# EAGLE design HECU_2.0 (EAGLE 9.6.2)
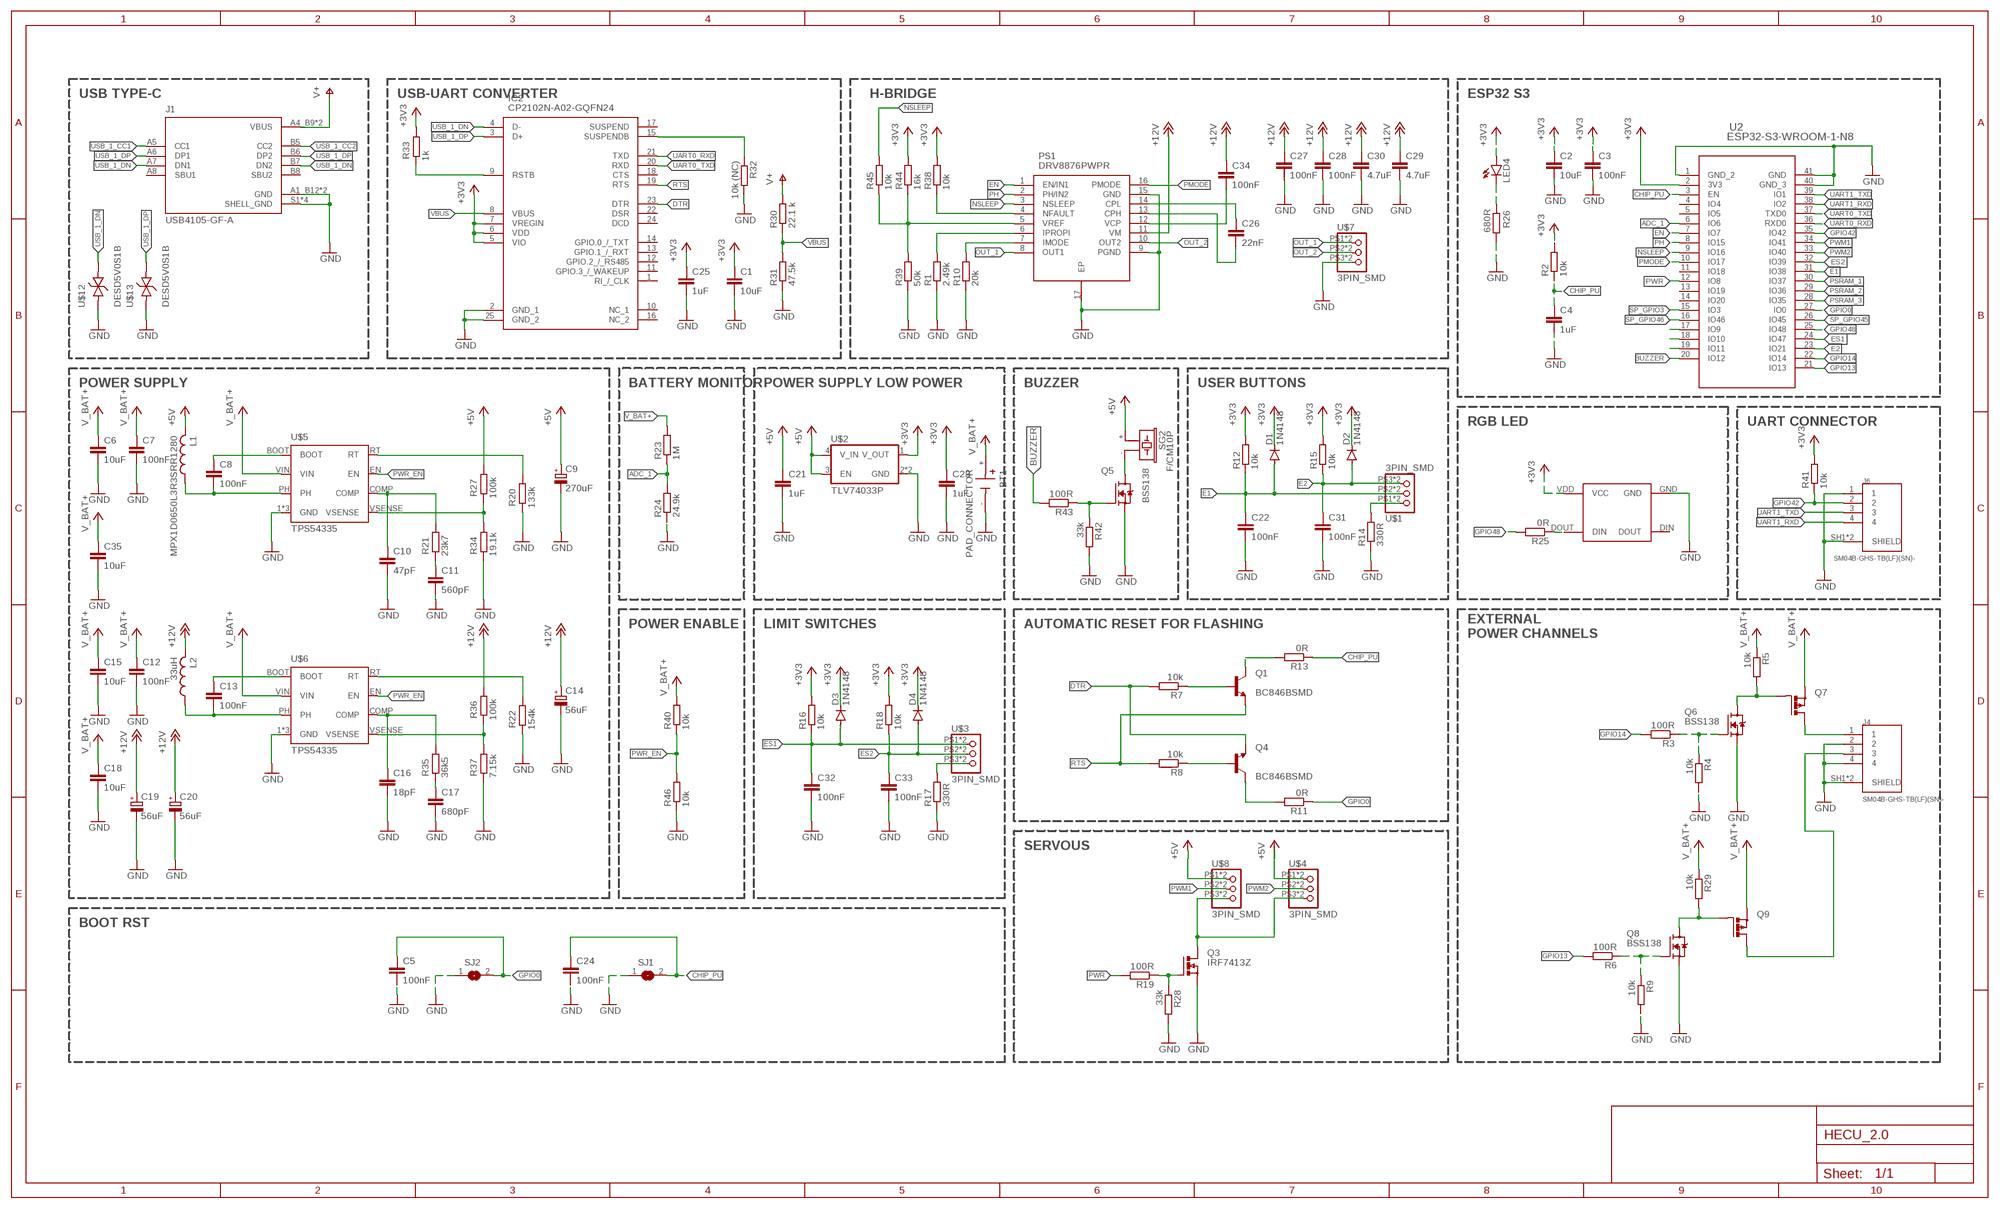
[diagram p0: schematic, sheet 1]

## Parts
BT1  PAD_CONNECTOR  [BAT_PADS]
C1  10uF  C-EUC0805  [C0805]
C2  10uF  C-EUC0805  [C0805]
C3  100nF  C-EUC0603  [C0603]
C4  1uF  C-EUC0603  [C0603]
C5  100nF  C-EUC0603  [C0603]
C6  10uF  C-EUC0805  [C0805]
C7  100nF  C-EUC0603  [C0603]
C8  100nF  C-EUC0603  [C0603]
C9  270uF  CPOL-EUE  [PANASONIC_E]
C10  47pF  C-EUC0603  [C0603]
C11  560pF  C-EUC0603  [C0603]
C12  100nF  C-EUC0603  [C0603]
C13  100nF  C-EUC0603  [C0603]
C14  56uF  CPOL-EUC  [PANASONIC_C]
C15  10uF  C-EUC0805  [C0805]
C16  18pF  C-EUC0603  [C0603]
C17  680pF  C-EUC0603  [C0603]
C18  10uF  C-EUC0805  [C0805]
C19  56uF  CPOL-EUC  [PANASONIC_C]
C20  56uF  CPOL-EUC  [PANASONIC_C]
C21  1uF  C-EUC0603  [C0603]
C22  100nF  C-EUC0603  [C0603]
C23  1uF  C-EUC0603  [C0603]
C24  100nF  C-EUC0603  [C0603]
C25  1uF  C-EUC0603  [C0603]
C26  22nF  C-EUC0603  [C0603]
C27  100nF  C-EUC0603  [C0603]
C28  100nF  C-EUC0603  [C0603]
C29  4.7uF  C-EUC0603  [C0603]
C30  4.7uF  C-EUC0603  [C0603]
C31  100nF  C-EUC0603  [C0603]
C32  100nF  C-EUC0603  [C0603]
C33  100nF  C-EUC0603  [C0603]
C34  100nF  C-EUC0603  [C0603]
C35  10uF  C-EUC0805  [C0805]
D1  1N4148  1N4148SOD80C  [SOD80C]
D2  1N4148  1N4148SOD80C  [SOD80C]
D3  1N4148  1N4148SOD80C  [SOD80C]
D4  1N4148  1N4148SOD80C  [SOD80C]
IC2  CP2102N-A02-GQFN24  [QFN50P400X400X80-25N]
J1  USB4105-GF-A  [GCT_USB4105-GF-A]
J4  SM04B-GHS-TB(LF)(SN)-  [JST_SM04B-GHS-TB(LF)(SN)-]
J6  SM04B-GHS-TB(LF)(SN)-  [JST_SM04B-GHS-TB(LF)(SN)-]
L1  MPX1D0650L3R3SRR1280  [COIL_SRR1280]
L2  33uH  MPX1D0650L3R3COIL_MSS1210  [COIL_MSS1210]
LED4  LEDCHIPLED_0805  [CHIPLED_0805]
PS1  DRV8876PWPR  [SOP65P640X120-17N]
Q1  BC846BSMD  [SOT23]
Q3  IRF7413Z  N-MOSFET-SO8S  [SO-08]
Q4  BC846BSMD  [SOT23]
Q5  BSS138  [SOT23]
Q6  BSS138  [SOT23]
Q7  P-MOSFET-SO8  [SO-08]
Q8  BSS138  [SOT23]
Q9  P-MOSFET-SO8  [SO-08]
R1  2.49k  R-EU_R0603  [R0603]
R2  10k  R-EU_R0603  [R0603]
R3  100R  R-EU_R0603  [R0603]
R4  10k  R-EU_R0603  [R0603]
R5  10k  R-EU_R0603  [R0603]
R6  100R  R-EU_R0603  [R0603]
R7  10k  R-EU_R0603  [R0603]
R8  10k  R-EU_R0603  [R0603]
R9  10k  R-EU_R0603  [R0603]
R10  20k  R-EU_R0603  [R0603]
R11  0R  R-EU_R0603  [R0603]
R12  10k  R-EU_R0603  [R0603]
R13  0R  R-EU_R0603  [R0603]
R14  330R  R-EU_R0603  [R0603]
R15  10k  R-EU_R0603  [R0603]
R16  10k  R-EU_R0603  [R0603]
R17  330R  R-EU_R0603  [R0603]
R18  10k  R-EU_R0603  [R0603]
R19  100R  R-EU_R0603  [R0603]
R20  133k  R-EU_R0603  [R0603]
R21  23k7  R-EU_R0603  [R0603]
R22  154k  R-EU_R0603  [R0603]
R23  1M  R-EU_R0603  [R0603]
R24  24.9k  R-EU_R0603  [R0603]
R25  0R  R-EU_R0603  [R0603]
R26  680R  R-EU_R0603  [R0603]
R27  100k  R-EU_R0603  [R0603]
R28  33k  R-EU_R0603  [R0603]
R29  10k  R-EU_R0603  [R0603]
R30  22.1 k  R-EU_R0603  [R0603]
R31  47.5k  R-EU_R0603  [R0603]
R32  10k (NC)  R-EU_R0603  [R0603]
R33  1k  R-EU_R0603  [R0603]
R34  19.1k  R-EU_R0603  [R0603]
R35  36k5  R-EU_R0603  [R0603]
R36  100k  R-EU_R0603  [R0603]
R37  7.15k  R-EU_R0603  [R0603]
R38  10k  R-EU_R0603  [R0603]
R39  50k  R-EU_R0603  [R0603]
R40  10k  R-EU_R0603  [R0603]
R41  10k  R-EU_R0603  [R0603]
R42  33k  R-EU_R0603  [R0603]
R43  100R  R-EU_R0603  [R0603]
R44  16k  R-EU_R0603  [R0603]
R45  10k  R-EU_R0603  [R0603]
R46  10k  R-EU_R0603  [R0603]
RGB1  SK6812MINI  [2020REVMNT]
SG2  F/CM10P  [F/CM10P]
SJ1  SJ  [SJ]
SJ2  SJ  [SJ]
U2  ESP32-S3-WROOM-1-N8  [ESP32-S3-WROOM-1-N8_EXP]
U$1  3PIN_SMD  [3PIN_PAD]
U$2  TLV74033P  [SUP_TPS3831L30DQNR]
U$3  3PIN_SMD  [3PIN_PAD]
U$4  3PIN_SMD  [3PIN_PAD]
U$5  TPS54335  TPS54325  [DDA0008E_L]
U$6  TPS54335  TPS54325  [DDA0008E_L]
U$7  3PIN_SMD  [3PIN_PAD]
U$8  3PIN_SMD  [3PIN_PAD]
U$12  DESD5V0S1B  [DIO_BAS316_RRG]
U$13  DESD5V0S1B  [DIO_BAS316_RRG]

## Nets
+3V3: C1.1 C2.1 C3.1 C23.1 C25.1 D1.C D2.C D3.C D4.C IC2.5(VIO) IC2.6(VDD) IC2.7(VREGIN) LED4.A R2.2 R12.2 R15.2 R16.2 R18.2 R33.1 R38.2 R41.2 R44.2 RGB1.VDD(VCC) U2.2(3V3) U$2.1(V_OUT)
+5V: C9.+ C21.1 L1.2 R27.1 SG2.+ U$2.3(EN) U$2.4(V_IN) U$4.P$1 U$4.P$4 U$8.P$1 U$8.P$4
+12V: C14.+ C19.+ C20.+ C27.1 C28.1 C29.1 C30.1 C34.1 L2.2 PS1.11(VM) R36.1
ADC_1: R23.1 R24.2 U2.6(IO6)
BUZZER: R43.2 U2.20(IO12)
CHIP_PU: C4.1 C24.1 R2.1 R13.1 SJ1.2 U2.3(EN)
DTR: IC2.23(DTR) Q4.2(E) R7.2
E1: C22.1 D1.A R12.1 U2.31(IO38) U$1.P$2 U$1.P$5
E2: C31.1 D2.A R15.1 U2.23(IO21) U$1.P$3 U$1.P$6
EN: PS1.1(EN/IN1) U2.7(IO7)
ES1: C32.1 D3.A R16.1 U2.24(IO47) U$3.P$1 U$3.P$4
ES2: C33.1 D4.A R18.1 U2.32(IO39) U$3.P$2 U$3.P$5
GND: BT1.- C1.2 C2.2 C3.2 C4.2 C5.2 C6.2 C7.2 C9.- C10.2 C11.2 C12.2 C14.- C15.2 C16.2 C17.2 C18.2 C19.- C20.- C21.2 C22.2 C23.2 C24.2 C25.2 C27.2 C28.2 C29.2 C30.2 C31.2 C32.2 C33.2 C35.2 IC2.2(GND_1) IC2.25(GND_2) J1.A1_B12(GND) J1.B1_A12(GND) J1.S1(SHELL_GND) J1.S2(SHELL_GND) J1.S3(SHELL_GND) J1.S4(SHELL_GND) J4.2 J4.4 J4.SH1(SHIELD) J4.SH2(SHIELD) J6.1 J6.SH1(SHIELD) J6.SH2(SHIELD) PS1.9(PGND) PS1.15(GND) PS1.17(EP) Q3.1(S) Q3.2(S) Q3.3(S) Q5.2(S) Q6.2(S) Q8.2(S) R1.1 R4.2 R9.2 R10.1 R14.1 R17.1 R20.2 R22.2 R24.1 R26.1 R28.2 R31.1 R32.2 R34.2 R37.2 R39.1 R42.2 R46.1 RGB1.GND SJ1.1 SJ2.1 U2.1(GND_2) U2.40(GND_3) U2.41(GND) U$2.2(GND) U$2.5(GND) U$5.1(GND) U$5.9(GND) U$5.GND U$6.1(GND) U$6.9(GND) U$6.GND U$7.P$3 U$7.P$6 U$12.A U$13.A
GPIO0: C5.1 R11.1 SJ2.2 U2.27(IO0)
GPIO13: R6.2 U2.21(IO13)
GPIO14: R3.2 U2.22(IO14)
GPIO42: J6.2 R41.1 U2.35(IO42)
GPIO48: R25.2 U2.25(IO48)
N$1: R17.2 U$3.P$3 U$3.P$6
N$2: R14.2 U$1.P$1 U$1.P$4
N$3: J4.1 Q7.5(D) Q7.6(D) Q7.7(D) Q7.8(D)
N$4: Q1.3(C) R13.2
N$5: Q6.1(G) R3.1 R4.1
N$6: Q4.3(C) R11.2
N$7: R20.1 U$5.RT
N$8: C10.1 R21.1 U$5.COMP
N$9: C8.1 U$5.BOOT
N$10: Q4.1(B) R8.1
N$11: Q5.3(D) SG2.-
N$12: Q1.1(B) R7.1
N$13: IC2.15(SUSPENDB) R32.1
N$14: Q6.3(D) Q7.4(G) R5.2
N$15: Q3.5(D) Q3.6(D) Q3.7(D) Q3.8(D) U$4.P$3 U$4.P$6 U$8.P$3 U$8.P$6
N$16: R25.1 RGB1.DOUT(DIN)
N$17: LED4.C R26.2
N$18: Q8.1(G) R6.1 R9.1
N$19: Q8.3(D) Q9.4(G) R29.2
N$20: Q5.1(G) R42.1 R43.1
N$21: C8.2 L1.1 U$5.PH
N$22: IC2.9(RSTB) R33.2
N$23: R27.2 R34.1 U$5.VSENSE
N$24: C11.1 R21.2
N$25: R22.1 U$6.RT
N$26: C16.1 R35.1 U$6.COMP
N$27: C13.1 U$6.BOOT
N$28: C13.2 L2.1 U$6.PH
N$29: J4.3 Q9.5(D) Q9.6(D) Q9.7(D) Q9.8(D)
N$30: R36.2 R37.1 U$6.VSENSE
N$31: Q3.4(G) R19.1 R28.1
N$32: C17.1 R35.2
N$34: C34.2 PS1.12(VCP)
N$35: C26.1 PS1.14(CPL)
N$36: C26.2 PS1.13(CPH)
N$38: PS1.6(IPROPI) R1.2
N$39: PS1.7(IMODE) R10.2
N$40: PS1.4(NFAULT) R38.1
N$41: PS1.5(VREF) R39.2 R44.1 R45.1
NSLEEP: PS1.3(NSLEEP) R45.2 U2.9(IO16)
OUT_1: PS1.8(OUT1) U$7.P$1 U$7.P$4
OUT_2: PS1.10(OUT2) U$7.P$2 U$7.P$5
PD_INT: U2.17(IO9)
PD_SCL: U2.19(IO11)
PD_SDA: U2.18(IO10)
PH: PS1.2(PH/IN2) U2.8(IO15)
PMODE: PS1.16(PMODE) U2.10(IO17)
PSRAM_1: U2.30(IO37)
PSRAM_2: U2.29(IO36)
PSRAM_3: U2.28(IO35)
PWM1: U2.34(IO41) U$8.P$2 U$8.P$5
PWM2: U2.33(IO40) U$4.P$2 U$4.P$5
PWR: R19.2 U2.12(IO8)
PWR_EN: R40.1 R46.2 U$5.EN U$6.EN
RTS: IC2.19(RTS) Q1.2(E) R8.2
SP_GPIO3: U2.15(IO3)
SP_GPIO45: U2.26(IO45)
SP_GPIO46: U2.16(IO46)
UART0_RXD: IC2.21(TXD) U2.36(RXD0)
UART0_TXD: IC2.20(RXD) U2.37(TXD0)
UART1_RXD: J6.4 U2.38(IO2)
UART1_TXD: J6.3 U2.39(IO1)
USB_1_CC1: J1.A5(CC1)
USB_1_CC2: J1.B5(CC2)
USB_1_DN: IC2.4(D-) J1.A7(DN1) J1.B7(DN2) U$12.C
USB_1_DP: IC2.3(D+) J1.A6(DP1) J1.B6(DP2) U$13.C
V+: J1.A4_B9(VBUS) J1.B4_A9(VBUS) R30.2
V_BAT+: BT1.+ C6.1 C7.1 C12.1 C15.1 C18.1 C35.1 Q7.1(S) Q7.2(S) Q7.3(S) Q9.1(S) Q9.2(S) Q9.3(S) R5.1 R23.2 R29.1 R40.2 U$5.VIN U$6.VIN
VBUS: IC2.8(VBUS) R30.1 R31.2
Unconnected: IC2.1(RI_/_CLK) IC2.10(NC_1) IC2.11(GPIO.3_/_WAKEUP) IC2.12(GPIO.2_/_RS485) IC2.13(GPIO.1_/_RXT) IC2.14(GPIO.0_/_TXT) IC2.16(NC_2) IC2.17(SUSPEND) IC2.18(CTS) IC2.22(DSR) IC2.24(DCD) J1.A8(SBU1) J1.B8(SBU2) RGB1.DIN(DOUT) U2.4(IO4) U2.5(IO5) U2.11(IO18) U2.13(IO19) U2.14(IO20)

## Notes on the sheet
- USB TYPE-C | USB-UART CONVERTER | H-BRIDGE | ESP32 S3
- POWER SUPPLY | BATTERY MONITOR | POWER SUPPLY LOW POWER | BUZZER | USER BUTTONS
- RGB LED | UART CONNECTOR
- POWER ENABLE | LIMIT SWITCHES | AUTOMATIC RESET FOR FLASHING
- EXTERNAL
  POWER CHANNELS
- SERVOUS
- BOOT RST

## Library data of the parts
BT1 = PUTRocketLab_connectors:PAD_CONNECTOR: Battery Holder (Open) 18650 1 Cell PC Pin Check availability <https://pricing.snapeda.com/parts/BK-18650-PC2/MPD%20%28Memory%20Protection%20Devices%29/view-part?ref=eda>
C1-C8 C10-C13 C15-C18 C21-C35 = PUTRocketLab_RCL:C-EU: CAPACITOR, European symbol; SPICEPREFIX: C
C9 C14 C19 C20 = PUTRocketLab_RCL:CPOL-EU: POLARIZED CAPACITOR, European symbol; SPICEPREFIX: C
D1-D4 = PUTRocketLab_semiconductors:1N4148: DIODE
IC2 = PUTRocketLab_IC:CP2102N-A02-GQFN24: USB Interface IC USB to UART bridge - QFN24 Source: Datasheet <https://componentsearchengine.com/Datasheets/1/CP2102N-A02-GQFN24.pdf> Check availability <https://pricing.snapeda.com/parts/CP2102N-A02-GQFN24/Silicon%20Labs/view-part?ref=eda>; AVAILABILITY: In Stock; DESCRIPTION: USB Bridge, USB to UART USB 2.0 UART Interface 24-QFN (4x4); MF: Silicon Labs; MP: CP2102N-A02-GQFN24; PACKAGE: WFQFN-24 Silicon Labs; PRICE: None; PURCHASE-URL: https://pricing.snapeda.com/search/part/CP2102N-A02-GQFN24/?ref=eda
J1 = PUTRocketLab_connectors:USB4105-GF-A: USB-C (USB TYPE-C) USB 2.0 Receptacle Connector 24 (16+8 Dummy) Position Surface Mount, Right Angle; Through Hole Check availability <https://pricing.snapeda.com/parts/USB4105-GF-A/GCT/view-part?ref=eda>; AVAILABILITY: In Stock; DESCRIPTION: USB-C (USB TYPE-C) USB 2.0 Receptacle Connector 24 (16+8 Dummy) Position Surface Mount, Right Angle; Through Hole; MF: GCT; MP: USB4105-GF-A; PACKAGE: None; PRICE: None; PURCHASE-URL: https://pricing.snapeda.com/search/part/USB4105-GF-A/?ref=eda
J4 J6 = PUTRocketLab_connectors:SM04B-GHS-TB(LF)(SN)-: Conn Header Gh Side 4pos 1.25mm; DESCRIPTION: Connector Header Surface Mount, Right Angle 4 position 0.049 (1.25mm); DIGI-KEY_PART_NUMBER: 455-1566-6-ND; MF: JST Sales; MP: SM04B-GHS-TB(LF)(SN)-; PACKAGE: None; PURCHASE-URL: https://pricing.snapeda.com/search/part/SM04B-GHS-TB(LF)(SN)-/?ref=eda
L1 L2 = PUTRocketLab_RCL:MPX1D0650L3R3
LED4 = PUTRocketLab_semiconductors:LED: LED OSRAM: - CHIPLED LG R971, LG N971, LY N971, LG Q971, LY Q971, LO R971, LY R971 LH N974, LH R974 LS Q976, LO Q976, LY Q976 LO Q996 - Hyper CHIPLED LW Q18S LB Q993, LB Q99A, LB R99A - SideLED LS A670, LO A670, LY A670, LG A670, LP A670 LB A673, LV A673, LT A673, LW A673 LH A674 LY A675 LS A676, LA A676, LO A676, LY A676, LW A676 LS A679, LY A679, LG A679 - Hyper Micro SIDELED® LS Y876, LA Y876, LO Y876, LY Y876 LT Y87S - SmartLED LW L88C, LW L88S LB L89C, LB L89S, LG L890 LS L89K, LO L89K, LY L89K LS L896, LA L896, LO L896, LY L896 - TOPLED LS T670, LO T670, LY T670, LG T670, LP T670 LSG T670, LSP T670, LSY T670, LOP T670, LYG T670 LG T671, LOG T671, LSG T671 LB T673, LV T673, LT T673, LW T673 LH T674 LS T676, LA T676, LO T676, LY T676, LB T676, LH T676, LSB T676, LW T676 LB T67C, LV T67C, LT T67C, LS T67K, LO T67K, LY T67K, LW E67C LS E67B, LA E67B, LO E67B, LY E67B, LB E67C, LV E67C, LT E67C LW T67C LS T679, LY T679, LG T679 LS T770, LO T770, LY T770, LG T770, LP T770 LB T773, LV T773, LT T773, LW T773 LH T774 LS E675, LA E675, LY E675, LS T675 LS T776, LA T776, LO T776, LY T776, LB T776 LHGB T686 LT T68C, LB T68C - Hyper Mini TOPLED® LB M676 - Mini TOPLED Santana® LG M470 LS M47K, LO M47K, LY M47K Source: http://www.osram.convergy.de LUXEON: - LUMILED® LXK2-PW12-R00, LXK2-PW12-S00, LXK2-PW14-U00, LXK2-PW14-V00 LXK2-PM12-R00, LXK2-PM12-S00, LXK2-PM14-U00 LXK2-PE12-Q00, LXK2-PE12-R00, LXK2-PE12-S00, LXK2-PE14-T00, LXK2-PE14-U00 LXK2-PB12-K00, LXK2-PB12-L00, LXK2-PB12-M00, LXK2-PB14-N00, LXK2-PB14-P00, LXK2-PB14-Q00 LXK2-PR12-L00, LXK2-PR12-M00, LXK2-PR14-Q00, LXK2-PR14-R00 LXK2-PD12-Q00, LXK2-PD12-R00, LXK2-PD12-S00 LXK2-PH12-R00, LXK2-PH12-S00 LXK2-PL12-P00, LXK2-PL12-Q00, LXK2-PL12-R00 Source: www.luxeon.com KINGBRIGHT: KA-3528ASYC Source: www.kingbright.com
PS1 = PUTRocketLab_IC:DRV8876PWPR: 37-V, 3.5-A brushed DC motor driver with integrated current sensing and current sense output Source: Datasheet <http://www.ti.com/lit/ds/symlink/drv8876.pdf>; DESCRIPTION: 37-V, 3.5-A brushed DC motor driver with integrated current sensing and current sense output; HEIGHT: 1.2mm; MANUFACTURER_NAME: Texas Instruments; MANUFACTURER_PART_NUMBER: DRV8876PWPR; MOUSER_PART_NUMBER: 595-DRV8876PWPR; MOUSER_PRICE-STOCK: https://www.mouser.co.uk/ProductDetail/Texas-Instruments/DRV8876PWPR?qs=PqoDHHvF64%252BBALOlUWTZeA%3D%3D
Q1 Q4 = PUTRocketLab_semiconductors:BC846*: NPN Transistor
Q3 = PUTRocketLab_semiconductors:N-MOSFET-SO8: N-Channel MOSFET Example: FDS7760A; N-Channel Logic Level PowerTrench® MOSFET FDS2572; N-Channel UltraFET® Trench MOSFET Source: www.fairchildsemi.com
Q5 Q6 Q8 = PUTRocketLab_semiconductors:BSS138: BSS138 N-Channel Logic Level Enhancement Mode Field Effect Transistor Source: http://www.fairchildsemi.com/datasheets/BS/BSS138.pdf; MF: Fairchild; MPN: BSS138; OC_FARNELL: 9845330; OC_NEWARK: 67R2009
Q7 Q9 = PUTRocketLab_semiconductors:P-MOSFET-SO8: P-Channel MOSFET Example: FDS4435A; P-Channel Logic Level PowerTrench® MOSFET FDS4465; P-Channel 1.8V Specified PowerTrench® MOSFET Source: www.fairchildsemi.com
R1-R46 = PUTRocketLab_RCL:R-EU_: RESISTOR, European symbol; SPICEPREFIX: R
RGB1 = PUTRocketLab_IC:SK6812MINI: Check availability <https://pricing.snapeda.com/parts/SK6812MINI/DONGGUANG%20OPSCO%20OPTOELECTRONICS%20CO.%2C%20LTD/view-part?ref=eda>; AVAILABILITY: Not in stock; DESCRIPTION: INTEGRATED LIGHT SOURCE INTELLIGENT CONTROL OF CHIP-ON-TOP SMD TYPE LED; MF: DONGGUANG OPSCO OPTOELECTRONICS CO., LTD; MP: SK6812MINI; PACKAGE: Package; PRICE: None
SG2 = PUTRocketLab_misc:F/CM10P: BUZZER Source: Buerklin
SJ1 SJ2 = PUTRocketLab_misc:SJ: SMD solder JUMPER
U2 = esp32-s3:ESP32-S3-WROOM-1-N8; COPYRIGHT: Copyright (C) 2022 Ultra Librarian. All rights reserved.; DIGI-KEY_PART_NUMBER_1: 1965-ESP32-S3-WROOM-1-N8TR-ND; DIGI-KEY_PART_NUMBER_2: 1965-ESP32-S3-WROOM-1-N8CT-ND; DIGI-KEY_PART_NUMBER_3: 1965-ESP32-S3-WROOM-1-N8DKR-ND; MANUFACTURER_PART_NUMBER: ESP32-S3-WROOM-1-N8; MFR_NAME: Espressif Systems
U$1 U$3 U$4 U$7 U$8 = PUTRocketLab_connectors:3PIN_SMD
U$2 = PUTRocketLab_IC:TLV74033P
U$5 U$6 = PUTRocketLab_IC:TPS54325
U$12 U$13 = PUTRocketLab_semiconductors:DESD5V0S1B

## Net classes
1 U1: width 0.203 mm

## Board
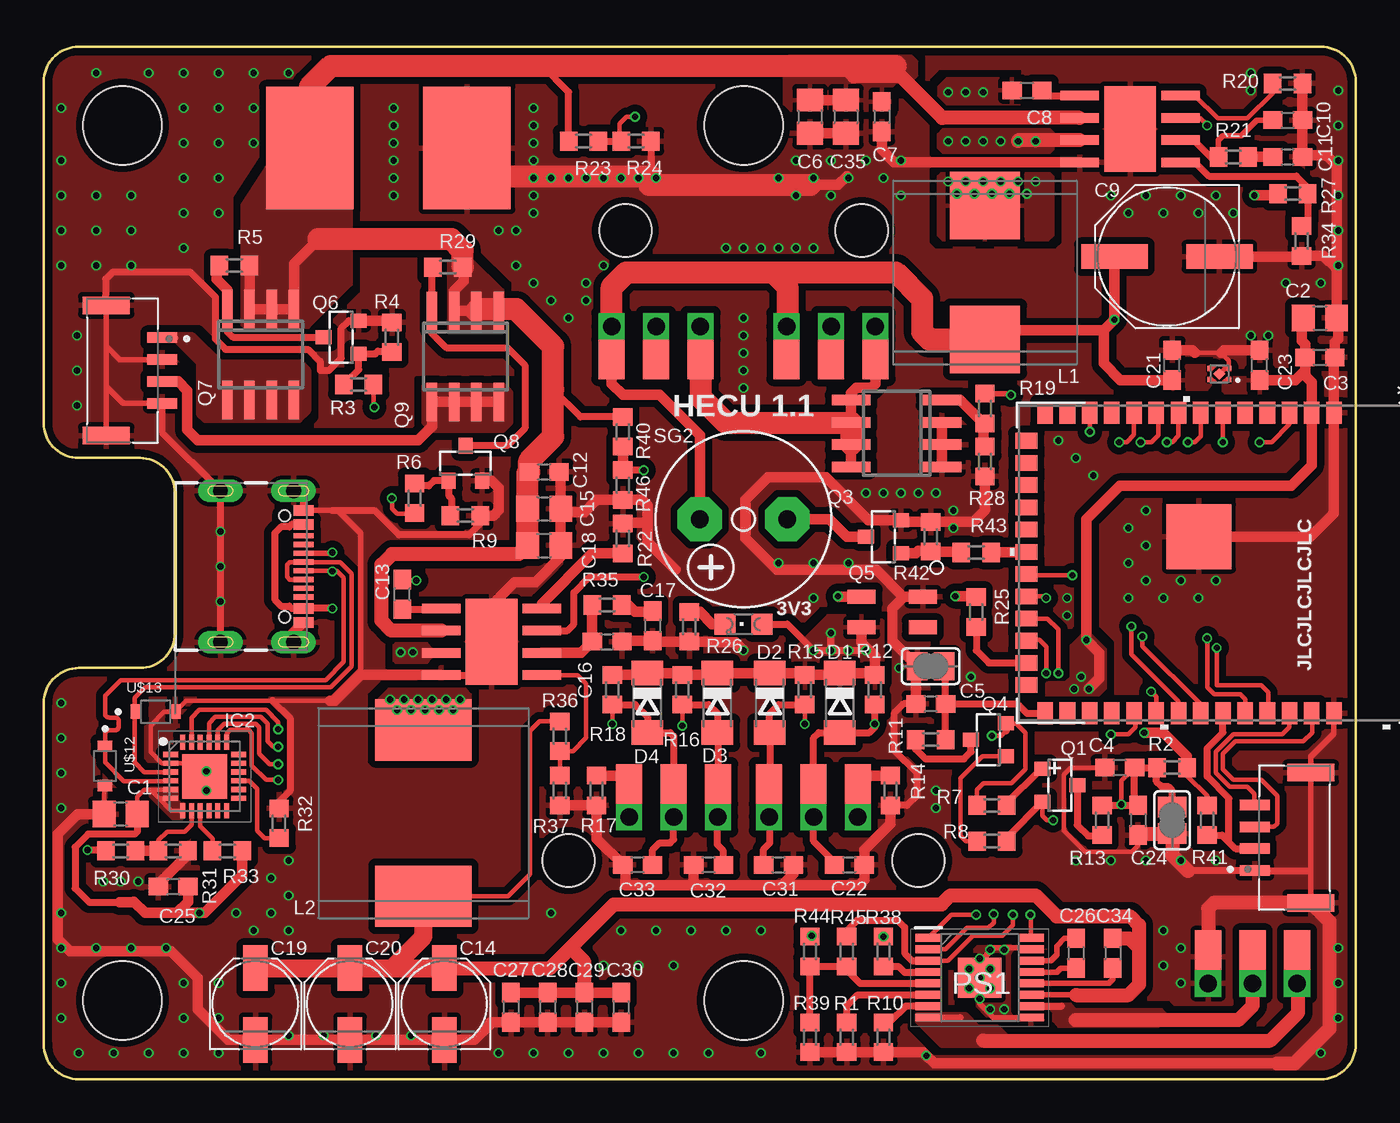
[diagram p1: board, top side]
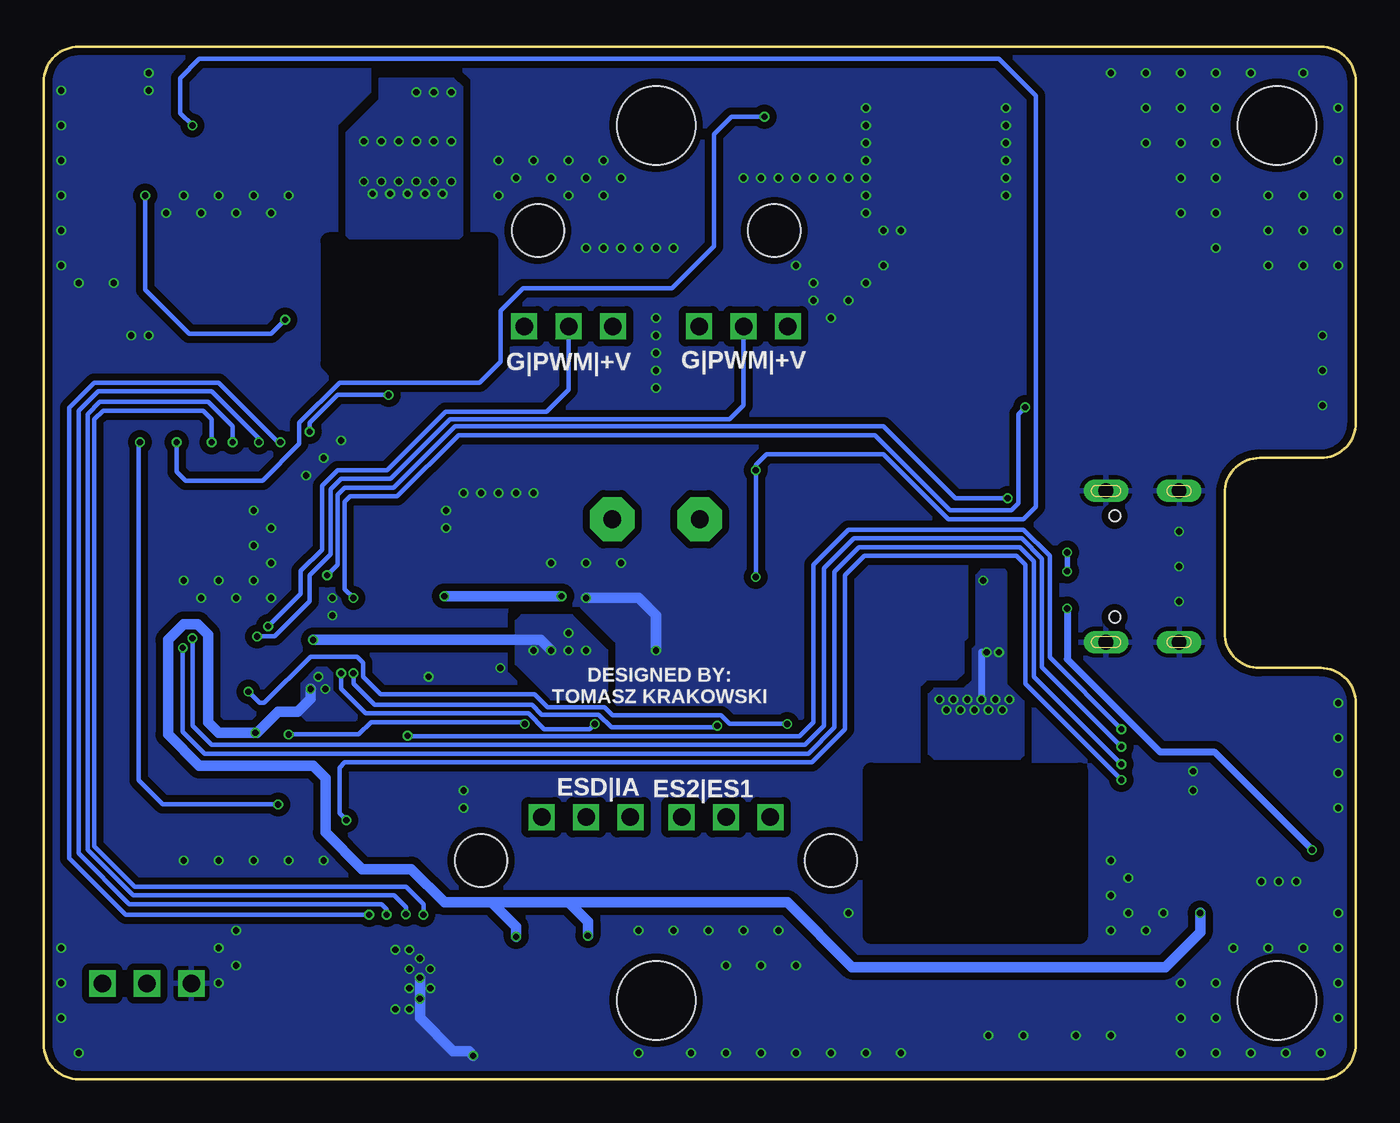
[diagram p2: board, bottom side, seen from below]

Size 75 x 59 mm. Coordinates in mm from the lower left corner, seen from the top.
Outline: 73,0 2,0 arc-90 0,2 0,21.5 arc-90 2,23.5 5.5,23.5 arc90 7.5,25.5 7.5,33.5 arc90 5.5,35.5 2,35.5 arc-90 0,37.5 0,57 arc-90 2,59 73,59 arc-90 75,57 75,2 arc-90 73,0
Copper layers (1*16): Top 0.035mm / dielectric 0.2mm / Bottom 0.035mm
Design rules "jlcpcb-2-layer *": minimum track width 10mil, minimum drill 0.2mm, track to track 3.5mil, track to pad 5mil, pad to pad 5mil, via to via 5mil, smd to smd 0mil, copper to edge 0.1mm, drill to drill 5mil, minimum pad ring 4mil, minimum via ring 4mil, stop-mask expansion 3mil, vias tented up to drill 100mil, thermal gap 10mil
Holes 4.5 mm at 4.5,4.5 40,54.5 4.5,54.5 40,4.5
Holes 3 mm at 33.25,48.5 46.75,48.5 30,12.5 50,12.5
bRestrict: area 15.8,8.2 to 27.7,17.6; area 49.5,40.4 to 58.7,47.9

### Footprints (pad centres in the part's own frame; a part is rotated, then mirrored left to right if it is on the bottom)
BAT_PADS = smd 5 x 7: + -4.49,0; - 4.49,0
C0805 = smd 1.3 x 1.5: 1 -0.95,0; 2 0.95,0
C0603 = smd 1.1 x 1: 1 -0.85,0; 2 0.85,0
PANASONIC_E = smd 3.8 x 1.4: + 3,0; - -3,0
PANASONIC_C = smd 2.6 x 1.4: + 2.05,0; - -2.05,0
SOD80C = smd 1.4 x 1.8: A 1.7,0; C -1.7,0
QFN50P400X400X80-25N = smd 0.85 x 0.3: 1 -1.95,1.25; 2 -1.95,0.75; 3 -1.95,0.25; 4 -1.95,-0.25; 5 -1.95,-0.75; 6 -1.95,-1.25; 13 1.95,-1.25; 14 1.95,-0.75; 15 1.95,-0.25; 16 1.95,0.25; 17 1.95,0.75; 18 1.95,1.25 | smd 0.3 x 0.85: 7 -1.25,-1.95; 8 -0.75,-1.95; 9 -0.25,-1.95; 10 0.25,-1.95; 11 0.75,-1.95; 12 1.25,-1.95; 19 1.25,1.95; 20 0.75,1.95; 21 0.25,1.95; 22 -0.25,1.95; 23 -0.75,1.95; 24 -1.25,1.95 | smd 2.55 x 2.55: 25 0,0
GCT_USB4105-GF-A = smd 0.6 x 1.15: A1_B12 -3.2,4.755; A4_B9 -2.4,4.755; B1_A12 3.2,4.755; B4_A9 2.4,4.755 | smd 0.3 x 1.15: A5 -1.25,4.755; A6 -0.25,4.755; A7 0.25,4.755; A8 1.25,4.755; B5 1.75,4.755; B6 0.75,4.755; B7 -0.75,4.755; B8 -1.75,4.755 | drill 0.85 pad 1.25 long: S1 -4.32,4.18; S2 -4.32,0; S3 4.32,0; S4 4.32,4.18 | hole 0.65: 2.89,3.68; -2.89,3.68
JST_SM04B-GHS-TB(LF)(SN)- = smd 0.6 x 1.7: 1 -1.875,2.275; 2 -0.625,2.275; 3 0.625,2.275; 4 1.875,2.275 | smd 1 x 2.7: SH1 -3.725,-0.925; SH2 3.725,-0.925
COIL_SRR1280 = smd 3.85 x 4: 1 -3.825,0; 2 3.825,0
COIL_MSS1210 = smd 3.5 x 5.5: 1 -4.75,0; 2 4.75,0
CHIPLED_0805 = smd 1.2 x 1.2: A 0,-1.05; C 0,1.05
SOP65P640X120-17N = smd 1.475 x 0.45: 1 -2.938,2.275; 2 -2.938,1.625; 3 -2.938,0.975; 4 -2.938,0.325; 5 -2.938,-0.325; 6 -2.938,-0.975; 7 -2.938,-1.625; 8 -2.938,-2.275; 9 2.938,-2.275; 10 2.938,-1.625; 11 2.938,-0.975; 12 2.938,-0.325; 13 2.938,0.325; 14 2.938,0.975; 15 2.938,1.625; 16 2.938,2.275 | smd 2.46 x 2.31: 17 0,0
SOT23 = smd 0.8 x 0.9: 1 -0.95,-1; 2 0.95,-1; 3 0,1
SO-08 = smd 0.6 x 2.2: 1 -1.905,-2.6; 2 -0.635,-2.6; 3 0.635,-2.6; 4 1.905,-2.6; 5 1.905,2.6; 6 0.635,2.6; 7 -0.635,2.6; 8 -1.905,2.6
R0603 = smd 1 x 1.1: 1 -0.85,0; 2 0.85,0
2020REVMNT = smd 1.6 x 0.8: DIN 1.75,-0.875; DOUT -1.75,0.875; GND 1.75,0.875; VDD -1.75,-0.875
F/CM10P = drill 1.016 pad 2.54 octagon: + 2.5,0; - -2.5,0
SJ = smd 1.168 x 1.6: 1 -0.762,0; 2 0.762,0
ESP32-S3-WROOM-1-N8_EXP = smd 1.27 x 0.889: 1 -8.581,5.254; 2 -8.581,3.984; 3 -8.581,2.714; 4 -8.581,1.444; 5 -8.581,0.174; 6 -8.581,-1.096; 7 -8.581,-2.366; 8 -8.581,-3.636; 9 -8.581,-4.906; 10 -8.581,-6.176; 11 -8.581,-7.446; 12 -8.581,-8.716; 13 -8.581,-9.986; 14 -8.581,-11.256; 27 8.581,-11.256; 28 8.581,-9.986; 29 8.581,-8.716; 30 8.581,-7.446; 31 8.581,-6.176; 32 8.581,-4.906; 33 8.581,-3.636; 34 8.581,-2.366; 35 8.581,-1.096; 36 8.581,0.174; 37 8.581,1.444; 38 8.581,2.714; 39 8.581,3.984; 40 8.581,5.254 | smd 0.889 x 1.27: 15 -6.985,-12.331; 16 -5.715,-12.331; 17 -4.445,-12.331; 18 -3.175,-12.331; 19 -1.905,-12.331; 20 -0.635,-12.331; 21 0.635,-12.331; 22 1.905,-12.331; 23 3.175,-12.331; 24 4.445,-12.331; 25 5.715,-12.331; 26 6.985,-12.331 | smd 3.708 x 3.708: 41 -1.496,-2.461
3PIN_PAD = smd 1.5 x 3: P$1 -2.54,0; P$2 0,0; P$3 2.54,0 | drill 1 square: P$4 -2.54,1.524; P$5 0,1.524; P$6 2.54,1.524
SUP_TPS3831L30DQNR = smd 0.254 x 0.254: 1 -0.55,0.335; 2 -0.55,-0.335; 3 0.55,-0.335; 4 0.55,0.335 | smd 0.48 x 0.48 rotated 315: 5 0,0
DDA0008E_L = smd 2.4 x 3.1: 1 0,0 | smd 2.95 x 4.9: 9 0,0 | smd 2.2 x 0.55: BOOT -2.875,1.905; COMP 2.875,-0.635; EN 2.875,0.635; GND -2.875,-1.905; PH -2.875,-0.635; RT 2.875,1.905; VIN -2.875,0.635; VSENSE 2.875,-1.905
DIO_BAS316_RRG = smd 0.63 x 0.83: A 1.115,0; C -1.115,0

### Placement (x,y rotation side)
BT1  19.7,53.2 0 top
C1  4.4,15.15 180 top
C2  72.95,43.5 0 top
C3  72.95,41.25 0 top
C4  61.5,17.8 180 top
C5  50.7,21.45 180 top
C6  43.8,55 270 top
C7  47.9,55 270 top
C8  56.2,56.5 180 top
C9  64.2,47 180 top
C10  71.1,54.8 0 top
C11  71.1,52.7 0 top
C12  28.6,34.7 0 top
C13  20.5,27.7 90 top
C14  22.9,4.3 90 top
C15  28.6,32.6 0 top
C16  32.2,25 0 top
C17  34.8,25.9 270 top
C18  28.6,30.5 0 top
C19  12.1,4.3 90 top
C20  17.5,4.3 90 top
C21  64.5,40.8 90 top
C22  46.05,12.25 0 top
C23  69.5,40.8 90 top
C24  62.55,14.8 270 top
C25  7.4,11 180 top
C26  59,7.2 270 top
C27  26.7,4.1 270 top
C28  28.8,4.1 270 top
C29  30.9,4.1 270 top
C30  33,4.1 270 top
C31  42,12.25 0 top
C32  38,12.25 180 top
C33  33.95,12.25 180 top
C34  61.1,7.2 270 top
C35  45.85,55 270 top
D1  45.5,21.5 270 top
D2  41.5,21.5 270 top
D3  38.5,21.5 270 top
D4  34.5,21.5 270 top
IC2  9.2,17.3 0 top
J1  10.1,29.3 270 top
J4  4.5,40.5 270 top
J6  71.5,13.8 90 top
L1  53.8,46.1 270 top
L2  21.7,15.2 270 top
LED4  40,26 90 top
PS1  53.5,5.8 0 top
Q1  58.08,16.8 270 top
Q3  48.75,36.9 90 top
Q4  54,19.4 90 top
Q5  48,31 90 top
Q6  17,42.4 90 top
Q7  12.4,41.4 180 top
Q8  24.1,35.2 0 top
Q9  24.1,41.3 180 top
R1  45.9,2.4 90 top
R2  64.5,17.8 0 top
R3  18,39.7 0 top
R4  19.9,42.4 90 top
R5  10.9,46.5 180 top
R6  21.2,33.2 270 top
R7  54.2,15.65 180 top
R8  54.2,13.6 0 top
R9  24.1,32.2 0 top
R10  48,2.4 90 top
R11  50.7,19.4 180 top
R12  47.5,22.25 90 top
R13  60.5,14.8 270 top
R14  48.4,16.5 90 top
R15  43.5,22.25 90 top
R16  36.5,22.25 90 top
R17  31.6,16.5 90 top
R18  32.5,22.25 90 top
R19  53.8,38.33 90 top
R20  71.1,56.9 0 top
R21  68,52.7 0 top
R22  33.1,30.9 90 top
R23  30.85,53.6 180 top
R24  33.85,53.6 180 top
R25  53.3,26.7 270 top
R26  36.9,25.85 90 top
R27  71.4,50.6 0 top
R28  53.8,35.3 270 top
R29  23.1,46.4 180 top
R30  4.4,13.05 180 top
R31  7.4,13.05 180 top
R32  13.45,14.62 90 top
R33  10.5,13.05 180 top
R34  71.9,47.9 270 top
R35  32.2,27.1 0 top
R36  29.5,19.6 270 top
R37  29.5,16.5 270 top
R38  48,7.3 90 top
R39  43.8,2.4 90 top
R40  33.1,37 90 top
R41  66.5,14.8 90 top
R42  50.7,31 90 top
R43  53.3,30.1 0 top
R44  43.8,7.3 90 top
R45  45.9,7.3 90 top
R46  33.1,33.95 90 top
RGB1  48.5,26.7 0 top
SG2  40,32 180 top
SJ1  64.5,14.8 90 top
SJ2  50.7,23.6 0 top
U2  68.5,29.5 270 top
U$1  44,16.5 180 top
U$2  67.2,40.3 180 top
U$3  36,16.5 180 top
U$4  45,41.5 0 top
U$5  62.1,54.3 0 top
U$6  25.6,25 0 top
U$7  69.1,7 180 top
U$8  35,41.5 0 top
U$12  3.5,17.9 270 top
U$13  6.4,21 0 top

### Tracks (layer width: path | path; a pad name or v marks a point on that pad's centre or on a via)
+3V3  (via drill 0.35)
  Top 0.254: R41.2 66.5,16.2 65.35,17.35 R2.2 | 6.1,16.55 5.75,16.55 5.35,16.15 C1.1 | 6.1,16.55 IC2.5 | IC2.6 6.6,16.05 | 6.6,16.05 6.1,16.55 | IC2.7 7.3,15.35 6.6,16.05
  Top 0.406: C1.1 5.35,14.15 5.2,14 2.54,14 1.8,13.26 1.8,10.9 2.6,10.1 4.35,10.1 | v45,24.5 v44,24.5 42.5,26 LED4.A | v45,24.5 v46,24.5 v47,24.5 46.75,24.75 RGB1.VDD | v45,24.5 v45,25.5
  Top 0.61: R18.2 34.4,23.1 D4.C 36.4,23.2 R16.2 38.4,23.1 D3.C D2.C 43.4,23.2 R15.2 45.4,23.1 D1.C 47.4,23.2 R12.2 47.5,24.2 46.75,24.95 RGB1.VDD | 7.6,9.5 5.8,9.5 5.15,10.15 5.1,10.1 4.35,10.1 | 7.6,9.5 v8.9,9.5 9.2,9.5 11.35,11.65 R33.1 | v59.75,22.3 60.35,22.9 60.35,24.35 v59.6,25.1 59.6,32 61.5,33.9 71.3,33.9 72.48,35.08 U2.2 72.48,39.82 72.1,40.2 72.1,40.5 | R2.2 65.35,18.45 64,19.8 v62.9,19.8 | C25.1 8.25,10.15 7.6,9.5 | C2.1 71.9,43.4 71.9,42.2 72.1,42 C3.1 72.1,40.5 | C23.1 71.55,39.95 72.1,40.5 | v43.9,8.2 43.85,8.15 R44.2
  Bottom 0.61: v59.75,22.3 59.75,21.75 60.5,21 61.6,21 62.8,19.8 v62.9,19.8 65,19.8 65.6,20.4 65.6,25.4 66.2,26 67,26 67.9,25.1 67.9,19.7 66.1,17.9 59.6,17.9 58.9,17.2 58.9,14.1 56.8,12 54,12 52.1,10.1 49.4,10.1 | v59.6,25.1 46.6,25.1 v46,24.5 | 45,10.1 43.9,9 v43.9,8.2 | 49.4,10.1 45,10.1 | R38.2 48,8.7 49.4,10.1 | 45,10.1 32.5,10.1 28.8,6.4 10.9,6.4 8.9,8.4 v8.9,9.5
  other vias: 58.9,22.3 59.3,23 48,8.15
  pour Top: 69.8,39.2 67.5,39.2 67.4,39.3 67.4,39.8 67.7,40.1 69.7,40.1 69.9,39.9 69.9,39.3
  pour Top: 48,22.6 48,26.2 47.7,26.5 44.8,26.5 42.8,24.5 42.8,22.5 43,22.3 47.7,22.3
  pour Bottom: 42.8,24.5 44.8,26.5 47.7,26.5 48,26.2 48,23.7 46,21.7 43.3,21.7 42.8,22.2
  pour Bottom: 58.5,22.5 58.5,23.2 58.8,23.5 59.4,23.5 60.3,22.6 60.3,20.8 60,20.5 57.2,20.5 57.1,20.6 57.1,20.8 57.5,21.2 58.5,22.2
  pour Top: 60.3,21.9 57.3,21.9 57.3,22.6 57.4,22.7 58.4,22.7 58.7,23 58.7,24.8 59.3,25.4 59.9,25.4 60.7,24.6 60.7,22.3
  pour Top (no thermals): 6.1,16.6 6.1,16.2 7.4,14.9 7.9,14.9 8,15 8,15.7 7.8,15.7 7.6,15.9 7.6,16.6
+5V  (via drill 0.35)
  Top 0.61: C21.1 61.55,39.95 60.6,40.9 60.6,42.8 | SG2.+ 37.5,36.8 35.2,39.1 33.1,39.1 32.46,39.74 U$8.P$4 | R27.1 70.45,50.5 v69.2,50.5 | U$4.P$4 U$4.P$1 | L1.2 54.33,42.8 60.6,42.8 | 60.6,42.8 v61.2,43.4 C9.+
  Top 0.813: U$8.P$1 U$8.P$4
  Top 1.27: U$8.P$4 32.46,45.26 33.3,46.1 41.7,46.1 | 41.7,46.1 42.5,45.3 42.5,43.06 U$4.P$4 | L1.2 50.62,42.27 50.2,42.7 50.2,44.6 48.7,46.1 41.7,46.1
  Bottom 0.254: v61.2,43.4 62,42.6 66.7,42.6 69.2,45.1 v69.2,50.5
  pour Top: 66.5,40.2 66.8,39.9 66.8,39.7 66.5,39.4 64.5,39.4 64.5,40 65.3,40.8 66.8,40.8 66.8,40.7 66.5,40.4
+12V
  Top 0.254: L2.2 26.55,10.45 27.8,11.7 27.8,19.9 28.35,20.45 R36.1
  Top 0.305: PS1.11 58.98,4.82 59,4.8
  Top 0.61: C30.1 C29.1 C28.1 C27.1
  Top 0.813: 59,4.8 62,4.8 62.6,5.4 62.6,7.5 | 62.6,7.5 62.6,8.8 62.1,9.3 57.9,9.3 56.7,10.5 51.84,10.5 51.33,9.99 32.59,9.99 30.1,7.5 | C34.1 62.05,8.05 62.6,7.5 | C14.+ 28.95,6.35 30.1,7.5 | C29.1 30.9,6.7 30.1,7.5
  Top 1.016: C19.+ C20.+ 19.9,6.35 | 19.9,6.35 C14.+ | 19.9,6.35 21.7,8.15 L2.2
ADC_1  (via drill 0.35)
  Top 0.254: v67.4,36.4 U2.6 | v33.8,55 33.3,55 32.9,54.6 32.9,53.7 R24.2
  Top 0.406: R23.1 R24.2
  Bottom 0.254: v67.4,36.4 67.4,34.7 66.9,34.2 62.5,34.2 60.4,36.3 60.4,37.5 58.1,39.8 50.1,39.8 48.9,41 48.9,43.9 47.6,45.2 39.1,45.2 36.7,47.6 36.7,54 35.7,55 v33.8,55
BUZZER
  Top 0.61: R43.2 56.13,30.1 U2.20
CHIP_PU  (via drill 0.35)
  Top 0.254: C4.1 61.6,17.05 v61.6,15.7 | v69.5,36.4 70.2,36.4 71.21,37.41 U2.3
  Top 0.406: R13.1 C24.1 62.35,15.85 C4.1 63.6,17.8 | 63.6,17.8 R2.1 | SJ1.2 64.5,16.5 64.3,16.7 63.9,16.7 63.6,17 63.6,17.8
  Bottom 0.254: v61.6,15.7 68.2,15.7 69.58,17.08 69.58,36.4 v69.5,36.4
DTR  (via drill 0.35)
  Top 0.254: IC2.23 8.45,20.65 8.9,21.1 12.7,21.1 13.4,20.4 v13.4,20 | v54.2,19.63 54.73,19.63 55,19.9 | R7.2 53.35,16.55 53.7,16.9 55.3,16.9 56.1,17.7 56.1,19.8 55.6,20.3 55,20.3
  Top 0.406: Q4.2 55,20.3 55,19.9
  Bottom 0.254: v54.2,19.63 54.2,19.6 31.8,19.6 31,20.4 31,29.4 29,31.4 19,31.4 17.5,29.9 17.5,24.1 v13.4,20
E1  (via drill 0.35)
  Top 0.254: v61,19.7 62,19.7 62.4,20.1 62.4,20.84 U2.31
  Top 0.406: U$1.P$2 44,19.5 44.3,19.8 D1.A 47.2,19.8 47.5,20.1 v47.5,20.3 R12.1 | C22.1 45.2,12.4 44,13.6 U$1.P$5
  Top 0.61: U$1.P$2 U$1.P$5
  Bottom 0.254: v47.5,20.3 47.6,20.4 56.3,20.4 57,19.7 v61,19.7
E2  (via drill 0.35)
  Top 0.254: R15.1 v43.5,20.3 | U2.23 57.38,26.32 58,25.7 v58,23.2
  Top 0.406: R15.1 42,21.4 41.46,20.86 41.46,19.76 | U$1.P$3 41.5,16.54 D2.A | C31.1 41.15,13.15 41.5,13.5 41.5,14.94
  Top 0.61: 41.46,19.76 D2.A | U$1.P$3 U$1.P$6 41.5,14.94
  Bottom 0.254: v43.5,20.3 43.8,20 46.4,20 47.3,20.9 56.6,20.9 58,22.3 v58,23.2
EN  (via drill 0.35)
  Top 0.254: PS1.1 51.89,9.4 v53.3,9.4 | v65.4,36.4 65.8,36.4 66.13,36.73 U2.7
  Bottom 0.254: v53.3,9.4 53.3,10 54.3,11 69.8,11 72.1,13.3 72.1,37.7 71.6,38.2 65.9,38.2 65.4,37.7 v65.4,36.4
ES1  (via drill 0.35)
  Top 0.254: R16.1 v36.5,20.2 | v57.3,23.2 57.3,24.7 56.9,25.1 56.21,25.1 U2.24
  Top 0.406: R16.1 38,21.4 38.5,20.9 D3.A | 38.54,19.76 U$3.P$1 | C32.1 38.85,13.05 38.5,13.4 38.5,14.8 38.5,14.94 U$3.P$4
  Top 0.61: D3.A 38.54,19.76 | U$3.P$1 38.54,14.84 38.5,14.8
  Bottom 0.254: v36.5,20.2 36.6,20.1 42.55,20.1 43.28,20.83 46.53,20.83 47.1,21.4 56.1,21.4 57.3,22.6 v57.3,23.2
ES2  (via drill 0.35)
  Top 0.254: R18.1 v32.5,20.3 | v63.3,22.15 63.6,21.85 U2.32
  Top 0.406: R18.1 33.8,21.4 34.5,20.7 D4.A 35.8,19.8 36,19.6 U$3.P$2 | C33.1 34.8,13.1 35.2,13.5 35.8,13.5 36,13.7 U$3.P$5
  Top 0.61: U$3.P$2 U$3.P$5
  Bottom 0.254: v32.5,20.3 35.8,20.3 36.3,20.8 42.5,20.8 42.95,21.25 46.2,21.25 46.95,22 55.75,22 56.75,23 56.75,23.8 57.1,24.15 59.75,24.15 62.4,21.5 62.65,21.5 v63.3,22.15
GND  (via drill 0.35)
  Top 0.254: C24.2 62.55,13.35 62.2,13 59.5,13 58.3,14.2 58.3,17.4 58.7,17.8 C4.2 | 16.37,21.63 13.07,21.63 8.14,21.63 U$13.A 6.9,21 6.1,20.2 6.1,18.7 6.75,18.05 IC2.2 8.25,18.05 9,17.3 IC2.25 9.2,17.5 v9.3,17.6 | U$12.A 3.45,16.73 C1.2 | U$2.5 67.53,40.63 U$2.2 67.75,41.05 67.3,41.5 65.8,41.5 65.5,41.5
  Top 0.305: 16.37,21.63 18.1,23.36 18.1,31.2 16.8,32.5 16.5,32.5 J1.A1_B12 | J6.SH1 72.42,11.88 72.38,11.93 72.42,11.98 J6.SH2 72.42,18.43 73.75,19.75 U2.40 | J4.SH2 3.58,39.6 | 3.58,39.6 3.58,41.9 | 3.58,41.9 J4.SH1 | J4.2 4.35,41.12 3.58,41.9 | J4.4 4.55,38.62 3.58,39.6 | PS1.9 54.27,3.52 53.5,4.3 PS1.17 53.5,6.7 54.3,7.5 56.36,7.5 PS1.15
  Top 0.406: 65.4,11.9 65.42,11.93 J6.1 72.38,11.93 | J1.S3 J1.S2 6.77,36.95 J4.4 | J1.A1_B12 14.86,33.05 J1.S1 | 3.53,44.78 3.53,45.72 3.96,46.14 8.36,46.14 9.8,44.7 9.8,42.3 10.4,41.7 15.1,41.7 15.8,41 15.8,40.5 16.3,40.5 17,41.2 17,42.9 17.45,43.35 Q6.2 | R32.2 13.45,15.85 14.1,16.5 14.1,20.6 13.07,21.63 | R9.2 24.95,31.75 24.3,31.1 20.3,31.1 18.9,32.5 16.5,32.5 | R24.1 34.7,51.6 | 34.7,51.2 34.6,51.1 | C5.2 49.15,21.45 48.6,20.9 48.6,18.8 49.9,17.5 49.9,16.2 49.35,15.65 R14.1 | U$6.GND 25.7,23.09
  Top 0.61: Q3.3 Q3.2 Q3.1 | C5.2 49.85,23.51 SJ2.1 48.5,25.04 48.5,26.9 49.17,27.57 | RGB1.GND 49.17,27.57 | 49.17,27.57 49.12,27.57 47.6,29.1 41.9,29.1 40.1,30.9 40.1,33.1 41.4,34.4 44.7,34.4 47.15,31.95 Q5.2 49.1,31.85 R42.2 53.15,31.85 53.8,32.5 R28.2 | R31.1 8.23,13.03 8.23,12.83 6.55,11.15 C25.2 | J1.S4 14.2,24.9 14.2,25.45 J1.B1_A12 | Q6.2 19.8,43.35 R4.2 | Q8.2 25.6,34.2 26,33.8 26,32.5 25.7,32.2 R9.2 | 36.99,11.09 33.25,11.09 33.25,12.1 C33.2 31.6,13.75 R17.1 R37.2 | C32.2 37.15,11.25 36.99,11.09 | 36.99,11.09 42.2,11.09 | C31.2 42.85,11.75 42.2,11.09 | 42.2,11.09 46.59,11.09 46.9,11.4 C22.2 46.9,13.1 48.4,14.6 R14.1 | U2.41 65.5,31 72.4,31 73.75,32.35 U2.1 73.75,41.2 C3.2 73.8,42.1 74,42.3 74,43.4 C2.2 | C2.2 74.03,43.62 | R20.2 C10.2 C11.2 72.05,52.8 73.3,52.8 73.9,52.2 73.9,46.3 | C21.2 65.65,41.65 65.8,41.5 | 67.3,41.5 67.45,41.65 C23.2 69.3,41.85 | C16.2 33.1,25.05 C17.2 34.85,25 R26.1 38.14,25 38.17,24.97 39.53,24.97 v40,24.5 | 34.5,31.8 34.5,30.7 36.1,29.1 | 34.5,31.8 33.15,31.8 R22.2 | 34.5,31.8 34.5,32.8 34.2,33.1 R46.1 31.6,33.1 30.9,32.4 29.75,32.4 C15.2 | C15.2 29.55,34.6 C12.2 | C15.2 C18.2 29.55,29.85 28.1,28.4 26.9,28.4 25.9,27.4 25.9,26.3 25.6,26 U$6.9 26,24.6 26,23.4 25.7,23.09 | 16.37,21.63 16.63,21.63 18.1,23.1 22.63,23.1 | C1.2 1.95,15.15 0.8,14 0.8,8 1.5,7.3 7.3,7.3 8.8,5.8 8.8,4 10.55,2.25 C19.- C20.- C14.- 24.64,2.25 25.5,3.11 25.5,3.2 25.55,3.25 C27.2 C28.2 C29.2 C30.2 | 43.65,1.4 R39.1 R1.1 R10.1 50.25,1.55 v50.45,1.35 50.9,0.9 70.5,0.9 | C9.- 71.9,47 R34.2 73.15,47.05 73.9,46.3 | C2.2 73.9,46.3 | U$5.GND 48.61,52.39 47.9,53.1 C7.2 | C35.2 C6.2
  Top 0.61: 43.8,51.1 45.4,51.1 45.9,51.6
  Top 0.813: C24.2 62.64,14.04 SJ1.1 64.5,12.8 65.4,11.9 | U$7.P$6 U$7.P$3 66.56,9.76 66.88,10.07 J6.SH1 73.5,9 73.5,2.9 71.5,0.9 70.5,0.9
  Top 1.27: BT1.- 25.79,51.6 34.7,51.6 | 34.6,51.1 43.8,51.1
  Bottom 0.61: PS1.17 53.5,3.5 51.6,1.6 50.7,1.6 v50.45,1.35 | v40,24.5 40,26.5 41,27.5 v44,27.5
  other vias: 40,43.5 40,42.5 40,41.5 40,40.5 40,39.5 1.9,42.5 1.9,40.5 1.9,38.5 3.4,11.3 4.4,11.3 5.4,11.3 42,29.5 44,29.5 46,29.5 62,31.5 62,29.5 62,27.5 64,27.5 66,27.5 10.1,27.3 10.1,29.3 10.1,31.3 58,36.5 59,35.5 60,34.5 63,32.5 63,30.5 63,28.5 65,28.5 69,42.5 70,42.5 9.3,16.5 58.5,27.5 58.5,26.5 53,23 48.9,23.5 67,28.5 47,33.5 48,33.5 49,33.5 50,33.5 51,33.5 52,32.5 52,31.5 53.5,5.8 28,55.5 28,54.5 28,53.5 28,52.5 28,51.5 28,50.5 28,49.5 27,48.5 26,48.5 51,16.5 51,15.5 29,9.5 14,2.5 16,2.5 19,2.5 21,2.5 26,1.5 28,1.5 30,1.5 32,1.5 34,1.5 34,6.5 32,6.5 33,8.5 35,8.5 37,8.5 39,8.5 41,8.5 61,50.5 62,49.5 63,50.5 64,49.5 65,50.5 66,49.5 67,50.5 68,49.5 69,56.5 74,56.5 74,54.5 74,52.5 74,50.5 74,48.5 74,46.5 73,45.5 71,45.5 69,57.5 49,52.5 48,51.5 47,52.5 46,51.5 45,52.5 44,51.5 43,52.5 42,51.5 43,50.5 45,50.5 49,50.5 20,55.5 20,54.5 20,53.5 20,52.5 20,51.5 20,50.5 30,51.5 31,51.5 29,51.5 32,51.5 33,51.5 34,51.5 35,51.5 27,46.5 28,45.5 29,44.5 30,43.5 31,44.5 31,45.5 32,46.5 39,47.5 40,47.5 41,47.5 42,47.5 43,47.5 44,47.5 1,48.5 3,48.5 1,50.5 5,50.5 5,46.5 5,48.5 10,53.5 8,53.5 10,55.5 8,57.5 10,57.5 12,57.5 6,57.5 3,57.5 1,55.5 1,52.5 3,50.5 8,55.5 1,21.5 1,19.5 1,17.5 1,15.5 11,9.5 12,8.5 14,8.5 13,9.5 14,10.5 13,11.5 14,12.5 10,1.5 8,1.5 6,1.5 4,1.5 2,1.5 1,3.5 1,5.5 1,7.5 1,9.5 3,7.5 5,7.5 7,7.5 8,3.5 8,5.5 10,3.5 10,5.5 8,51.5 10,51.5 8,49.5 10,49.5 12,55.5 12,53.5 14,57.5 8,47.5 3,46.5 1,46.5 52.9,6.3 54.1,6.3 54.1,5.2 52.9,5.2 53.5,4.6 54.1,4 54.9,4 53.5,6.9 54.1,7.4 54.9,7.4 65,5.5 64,6.5 65,7.5 64,8.5 63,12.5 65,12.5 61,12.5 59,12.5 67,12.5 74,7.5 74,5.5 74,3.5 73,1.5 36,6.5 36,1.5 38,1.5 41,1.5
  pour Top (isolate 0.406, rank 2): -5.21,63.82 -5.21,-3.25 86.03,-3.25 86.03,63.82
  pour Bottom (isolate 0.406, rank 2): -6.91,64.05 -6.91,-2.25 87.78,-2.25 87.78,64.05
GPIO0
  Top 0.406: R11.1 C5.1 | C5.1 51.55,23.51 SJ2.2 | C5.1 55.65,21.45 56.2,20.9 57.23,20.9 U2.27
GPIO13  (via drill 0.35)
  Top 0.254: v58.8,28.8 56.23,28.8 U2.21 | v19.9,33.2 19.9,32.6 20.2,32.3 21.15,32.3 R6.2
  Bottom 0.254: v58.8,28.8 58.2,29.4 58.2,33.4 57.8,33.8 55,33.8 51.5,37.3 27,37.3 22.9,33.2 v19.9,33.2
GPIO14  (via drill 0.35)
  Top 0.254: R3.2 18.85,38.45 v18.9,38.4 | v57.3,27.5 57.2,27.59 U2.22
  Bottom 0.254: v57.3,27.5 57.8,28 57.8,33 57.5,33.3 54.8,33.3 51.3,36.8 27.5,36.8 23.2,32.5 19.7,32.5 19.3,32.9 19.3,38 v18.9,38.4
GPIO42
  Top 0.406: R41.1 67.35,13.95 67.75,13.55 | J6.2 68.12,13.18 67.75,13.55 | 67.75,13.55 67.75,16.05 66.5,17.3 66.5,18.9 67.4,19.8 U2.35
GPIO48
  Top 0.406: R25.2 53.3,24.5 54.02,23.79 U2.25
N$1
  Top 0.406: 33.6,16.64 33.5,16.54
  Top 0.61: 33.5,16.54 U$3.P$3 U$3.P$6 | R17.2 32.89,17.35 33.6,16.64
N$2
  Top 0.61: U$1.P$4 46.54,16 U$1.P$1 46.54,17.24 46.7,17.4 46.75,17.35 R14.2
N$3
  Top 0.254: J4.1 7.58,42.38
  pour Top (no thermals): 14.6,37.7 15.1,38.2 15.1,40.5 14.7,40.9 10.1,40.9 8.52,42.48 7.52,42.48 7.52,42.33 8.9,40.95 8.9,38 9.2,37.7
N$4
  Top 0.406: Q1.3 59.08,14.52 59.7,13.9 60.45,13.9 R13.2
N$5
  Top 0.406: R4.1 19.85,41.6 19.1,41.6 18.95,41.45 Q6.1 18,40.55 R3.1
N$6
  Top 0.406: R11.2 49.85,18.85 50.4,18.3 52.6,18.3 53,18.7 Q4.3
N$7
  Top 0.254: U$5.RT 65.8,56.2 67.1,54.9 68.8,54.9 70.25,56.35 R20.1
N$8
  Top 0.305: 66.92,52.48 R21.1 67.15,53.65 67.4,53.9 68.45,53.9 69.35,54.8 C10.1
  Top 0.406: U$5.COMP 65.73,53.66 66.92,52.48
N$9
  Top 0.406: C8.1 57.34,56.2 U$5.BOOT
N$10
  Top 0.254: Q4.1 53.65,18.45 52.4,17.2 52.4,13.9 52.7,13.6 R8.1
N$11
  Top 0.61: SG2.- 44.9,32 45.7,31.2 45.9,31 Q5.3
N$12
  Top 0.406: R7.1 54.92,15.65 57.02,17.75 Q1.1
N$13
  Top 0.254: R32.1 12.62,13.78 12.2,14.2 12.2,16.6 11.75,17.05 IC2.15
N$14
  Top 0.406: Q7.4 10.5,42.7 10.8,42.4 Q6.3
  Top 0.61: Q7.4 10.5,45.11 9.9,45.7 9.9,46.35 R5.2
N$15
  Top 0.61: Q3.8 Q3.7 | U$8.P$3 U$8.P$6 | U$4.P$6 U$4.P$3 47.54,39.74 47.3,39.5 46.45,39.5 46.15,39.2 Q3.5 Q3.6
  Top 1.27: U$8.P$3 37.54,38.96 39,37.5 46.12,37.5 Q3.6 Q3.7
N$16  (via drill 0.35)
  Top 0.61: RGB1.DOUT 45.42,27.57 v45.4,27.6 | v52.1,27.6 53.25,27.6 R25.1
  Bottom 0.61: v45.4,27.6 v52.1,27.6
N$17
  Top 0.61: R26.2 37.5,26.7 38.2,26 LED4.C
N$18
  Top 0.406: R9.1 23.3,32.25 23.3,33.2 23.15,33.35 Q8.1 22.3,34.2 22,33.9 21.35,33.9 R6.1
N$19
  Top 0.406: R29.2 22.2,46.34 Q9.4 22.2,42.61 23,41.8 26.5,41.8 27.5,40.8 27.5,37.2 26.5,36.2 Q8.3
N$20
  Top 0.61: Q5.1 49.85,30.05 50,30.2 50.65,30.2 R42.1 52.4,30.15 R43.1
N$21  (via drill 0.35)
  Top 0.813: U$5.PH 55.77,53.66 v55.7,53.6
  other vias: 51.7,53.6 52.7,53.6 53.7,53.6 54.7,53.6 56.7,53.6 52.7,56.4 53.7,56.4 51.7,56.4 51.7,51.3 52.7,51.3 53.7,51.3 54.7,51.3 55.7,51.3 56.7,51.3 56.2,50.6 55.2,50.6 54.2,50.6 53.2,50.6 52.2,50.6
  pour Bottom: 51.1,48.2 51.4,47.9 57.4,47.9 57.7,48.2 57.7,54.1 55.8,56 55.8,57.2 51.6,57.2 51.1,56.7
  pour Top: 55.8,57.2 51.6,57.2 51.1,56.7 51.1,56.2 51.6,55.7 55.8,55.7
  pour Top: 51.4,52.9 51.1,53.2 51.1,53.9 51.1,54 51.4,54.3 57.5,54.3 57.7,54.1 57.7,53.1 57.5,52.9
  pour Top: 51.1,51.6 51.3,51.8 57.2,51.8 57.5,51.8 57.7,51.6 57.7,48.2 57.4,47.9 51.4,47.9 51.1,48.2
N$22
  Top 0.254: IC2.9 8.95,14.45 9.65,13.75 R33.2
N$23
  Top 0.406: U$5.VSENSE 65.81,52.39 66.6,51.6 71.6,51.6 72.25,50.95 R27.2 72.25,49.1 R34.1
N$24
  Top 0.61: R21.2 C11.1
N$25
  Top 0.61: R22.1 31.35,30.05 28.48,27.18 U$6.RT
N$26
  Top 0.61: U$6.COMP 30.71,24.37 C16.1 R35.1
N$27
  Top 0.406: C13.1 22.67,26.85 U$6.BOOT
N$28  (via drill 0.35)
  Top 0.254: v21.3,28.5 20.55,28.5 C13.2
  Top 0.406: 19.45,19.95 L2.1
  Bottom 0.406: 21.4,24.4 21.4,21.9
  other vias: 20.4,24.4 21.1,24.4 19.8,21.7 20.6,21.7 21.4,21.7 22.2,21.7 23,21.7 23.8,21.7 20.2,21.1 21,21.1 21.8,21.1 22.6,21.1 23.4,21.1
  pour Bottom: 20,22.6 20,29 20.1,29.1 21.4,29.1 21.7,28.8 21.7,24.8 21.9,24.6 21.9,22.8 22.4,22.3 24.1,22.3 24.4,22 24.4,18.6 24.1,18.3 19.2,18.3 19,18.5 19,21.6
  pour Top (no thermals): 20.1,23.8 20,23.9 20,24.6 20,24.8 20.1,24.9 21.9,24.9 22.2,24.6 22.2,24.1 22,23.9 21.9,23.8
  pour Top (no thermals): 22.4,22.3 24.1,22.3 24.4,22 24.4,18.6 24.1,18.3 19.2,18.3 19,18.5 19,21.6 19.7,22.3
N$29
  Top 0.61: J4.3 7.67,39.88 8.2,39.35 8.2,37.1 8.8,36.5 21.4,36.5 22.2,37.3 Q9.5 Q9.6 Q9.7 Q9.8
  pour Top (no thermals): 21.7,39.65 26.3,39.65 26.7,39.25 26.7,37.5 26.25,37.05 22.15,37.05 21.7,37.5
N$30
  Top 0.254: U$6.VSENSE 30.51,23.09 31,22.6 31,19.5 30.25,18.75 R36.2 R37.1
N$31
  Top 0.61: Q3.4 52.39,38.8 53.73,37.48 | 53.73,37.48 R19.1 | R28.1 53.73,36.23 53.73,37.48
N$32
  Top 0.61: R35.2 33.4,27.1 33.8,26.7 34.75,26.7 C17.1
N$34
  Top 0.305: PS1.12 60.88,5.48 61.1,5.7 C34.2
N$35
  Top 0.305: PS1.14 57.58,6.77 57.9,7.1 57.9,7.6 58.35,8.05 C26.1
N$36
  Top 0.305: PS1.13 57.92,6.12 58.15,6.35 C26.2
N$38
  Top 0.406: R1.2 45.9,4.2 46.52,4.82 PS1.6
N$39
  Top 0.406: PS1.7 49.27,4.18 48.35,3.25 R10.2
N$40
  Top 0.406: R38.1 48.85,6.45 49.2,6.1 50.54,6.1 PS1.4
N$41
  Top 0.406: PS1.5 46.66,5.48 45.9,6.24 R45.1 R44.1 R39.2
NSLEEP  (via drill 0.35)
  Top 0.254: PS1.3 51.67,6.77 53.1,8.2 54.8,8.2 55.4,8.8 v55.4,9.4 | v62.7,36.4 63.3,36.4 63.7,36.8 63.7,37.98 U2.9
  Top 0.406: R45.2 45.9,8.49 46.5,9.09 48.8,9.09 49.2,8.69 49.2,7.2 49.62,6.77 PS1.3
  Bottom 0.254: v55.4,9.4 55.4,9.7 55.7,10 70.1,10 73,12.9 73,38.2 71.9,39.3 65.4,39.3 62.7,36.6 v62.7,36.4
OUT_1
  Top 0.406: PS1.8 52.38,3.52
  Top 0.813: 53.7,2.2 70.1,2.2 71.7,3.8 71.7,5.42 U$7.P$4 U$7.P$1
  pour Top (no thermals): 49.9,3.3 51.3,1.9 54.9,1.9 55.2,2.2 55.2,2.3 54.5,3 53.4,3 52.7,3.7 49.9,3.7
OUT_2
  Top 0.406: PS1.10 58.17,4.18
  Top 0.813: 58.98,3.38 68.28,3.38 69.1,4.2 U$7.P$5 U$7.P$2
  pour Top (no thermals): 57,4.3 58.7,4.3 59,4 63.9,4 64.2,3.7 64.2,3.5 63.7,3 58,3 57.7,3.3 57.7,3.8 57.4,4.1 57,4.1
PH  (via drill 0.35)
  Top 0.254: U2.8 64.86,36.76 64.5,36.4 v64.2,36.4 | v54.3,9.43 54.3,8.93 54.01,8.64 52.76,8.64 51.54,7.43 PS1.2
  Bottom 0.254: v64.2,36.4 64.2,37.3 65.6,38.7 71.8,38.7 72.5,38 72.5,13.1 69.9,10.5 54.97,10.5 54.3,9.83 v54.3,9.43
PMODE  (via drill 0.35)
  Top 0.254: v56.4,9.4 56.44,9.36 PS1.16 | U2.10 62.32,36.82 61.9,36.4 v61.47,36.4
  Bottom 0.254: v56.4,9.4 70.3,9.4 73.53,12.63 73.53,38.37 72.1,39.8 65,39.8 61.6,36.4 v61.47,36.4
PWM1  (via drill 0.35)
  Top 0.254: v62.8,25.3 62.8,24.75 66.13,21.42 U2.34
  Top 0.61: U$8.P$2 U$8.P$5
  Bottom 0.254: U$8.P$5 35,38.5 35.8,37.7 51.78,37.7 55.19,34.3 58,34.3 58.6,33.7 58.6,30 59.8,28.8 59.8,27.3 61.8,25.3 v62.8,25.3
PWM2  (via drill 0.35)
  Top 0.254: v62.17,25.88 62.17,24.27 64.86,21.59 U2.33
  Top 0.61: U$4.P$2 U$4.P$5
  Bottom 0.254: U$4.P$5 45,39.4 46.26,38.14 52.03,38.14 55.37,34.8 58.2,34.8 59.1,33.9 59.1,30.27 60.31,29.06 60.31,27.74 v62.17,25.88
PWR  (via drill 0.35)
  Top 0.254: U2.12 59.8,38.06 v59.8,37
  Top 0.305: v55.28,39.1 55.21,39.17 R19.2
  Bottom 0.254: v59.8,37 59.8,37.5 58.2,39.1 v55.28,39.1
PWR_EN  (via drill 0.35)
  Top 0.254: v66.5,54.5 66.1,54.9 65.01,54.9 U$5.EN
  Top 0.406: U$6.EN 29.94,25.63 30.3,26 30.3,27.8 31.2,28.7 v34.3,28.7 | v34.3,34.8 R46.2
  Top 0.61: R46.2 R40.1
  Bottom 0.254: v34.3,28.7 v34.3,34.8 34.3,35.1 33.7,35.7 27,35.7 23.3,32 19,32 18.3,32.7 18.3,56.2 20.4,58.3 66.1,58.3 67.2,57.2 67.2,55.2 v66.5,54.5
RTS  (via drill 0.35)
  Top 0.254: v57.7,14.8 57.35,14.8 57.08,15.07 Q1.2 | IC2.19 10.45,19.75 10.66,19.96 11.7,19.96 11.9,19.76 11.9,17.9 12.7,17.1 v13.4,17.1
  Top 0.406: R8.2 55.1,13.65 55.1,13.87 Q1.2
  Bottom 0.254: v57.7,14.8 58.1,15.2 58.1,17.8 57.8,18.1 31.1,18.1 29.2,20 29.2,28.8 28.1,29.9 19.4,29.9 18.9,29.4 18.9,22.6 v13.4,17.1
UART0_RXD  (via drill 0.35)
  Top 0.254: IC2.21 9.45,20.35 9.8,20.7 12.4,20.7 12.8,20.3 12.8,19.3 13.1,19 v13.4,19 | U2.36 68.67,21.73 68.4,22 66.9,22 66.5,22.4 v66.5,25.2
  Bottom 0.254: v66.5,25.2 66.5,20.2 65.4,19.1 31.5,19.1 30.4,20.2 30.4,29.2 28.7,30.9 19.1,30.9 17.94,29.74 17.94,23.54 v13.4,19
UART0_TXD  (via drill 0.35)
  Top 0.254: v67.05,24.65 67.05,22.5 69.6,22.5 70,22.1 70,20.98 U2.37 | v13.4,18 12.9,18 12.3,18.6 12.3,20.1 12.1,20.3 10.3,20.3 9.95,19.95 IC2.20
  Bottom 0.254: v67.05,24.65 67.05,19.85 65.8,18.6 31.3,18.6 29.8,20.1 29.8,29 28.4,30.4 19.2,30.4 18.4,29.6 18.4,23 v13.4,18
UART1_RXD
  Top 0.254: U2.38 71.21,20.11 70.8,19.7 68,19.7 67,18.7 67,17.5 67.8,16.7 68.8,16.7 69.2,16.3 69.2,15.68
  Top 0.305: 69.2,15.68 J6.4
UART1_TXD
  Top 0.254: J6.3 70.33,14.43 70.5,14.6 70.5,16.2 69.6,17.1 68,17.1 67.4,17.7 67.4,18.6 68.1,19.3 72,19.3 72.5,19.8 72.5,20.9
  Top 0.305: 72.5,20.9 U2.39
USB_1_DN  (via drill 0.35)
  Top 0.254: IC2.4 7.23,17.03 4.57,17.03 3.5,18.1 U$12.C 3.5,19.7 arc-90 3.74,19.94 4.06,19.94 arc90 4.3,20.18 4.3,20.43 arc90 4.06,20.67 3.74,20.67 arc-90 3.5,20.91 3.5,21.9 4.4,22.8 16.1,22.8 17.16,23.86 17.16,28.65 16.75,29.05 J1.A7 16.5,29.05
  Top 0.305: J1.B7 16.45,30.05 v16.5,30.1 | v16.5,29.02 16.5,29.05
  Bottom 0.305: v16.5,30.1 v16.5,29.02
USB_1_DP
  Top 0.254: 5.2,21.09 5.2,18.1 5.75,17.55 IC2.3 | U$13.C 5.2,21.09 | J1.B6 14.05,28.55 13.9,28.7 13.9,29.4 14.05,29.55 J1.A6 16.94,29.55 17.6,28.89 17.6,23.6 16.4,22.4 5.8,22.4 5.2,21.8 5.2,21.09
V+  (via drill 0.35)
  Top 0.406: v2.5,13.1 3.5,13.1 R30.2 | v16.5,26.9 J1.B4_A9 14.18,26.9 14.04,27.04 13.56,27.04 13.2,27.4 13.2,31.2 13.56,31.56 14.04,31.56 14.18,31.7 J1.A4_B9
  Bottom 0.406: v2.5,13.1 8.1,18.7 11.2,18.7 16.5,24 v16.5,26.9
V_BAT+
  Top 0.406: R23.2 30,56.4 28.5,57.9 | R40.2 30.68,37.85 29.13,39.4
  Top 0.61: Q9.1 Q9.2 Q9.3 23.46,45.06 24,45.6 24,46.35 R29.1 | R5.1 11.77,46.48 Q7.3 Q7.2 Q7.1 14.3,46.59 15.71,48 | C35.1 C6.1
  Top 0.813: U$6.VIN 19.86,25.63 19.3,26.2 19.3,29.4 19.9,30 27.15,30 C18.1 | U$5.VIN 51.37,54.94 49,57.3 46.3,57.3 45.7,57.9
  Top 1.27: 15.71,48 23.3,48 23.95,47.35 R29.1 | BT1.+ 15.21,56.71 16.4,57.9 28.5,57.9 45.7,57.9 48.7,57.9 | C18.1 C15.1 27.65,34.6 C12.1 27.75,35.34 29.13,36.72 29.13,39.4 29.13,41.87 27,44 24.84,44 Q9.2
  pour Top (no thermals): 11.3,43.09 11.3,49.97 12.86,52.34 17.6,52.54 17.6,45.39 15.15,42.94 11.45,42.94
  pour Top (no thermals): 23.1,42.65 26.25,42.65 26.25,45.1 24.4,46.95 23.4,46.95 23.1,46.65
  pour Top: 43.1,55.3 42.7,55.3 42.3,55.7 42.3,58.2 42.6,58.5 49.6,58.5 49.9,58.2 49.9,57.3 49.6,57 49.5,56.9 48.7,56.9 48.4,56.6 48.4,55.5 48.2,55.3
VBUS
  Top 0.254: IC2.8 8.45,14.55 8.05,14.15 7.05,14.15 6.55,13.65 R31.2
  Top 0.61: R31.2 R30.1

### Text on the board
tNames: HECU 1.1 | 3V3 | JLCJLCJLCJLC | +
bNames: G|PWM|+V | G|PWM|+V | DESIGNED BY: / TOMASZ KRAKOWSKI | ES2|ES1 | ESD|IA